# EAGLE design pymodel1 (EAGLE 9.0.0)
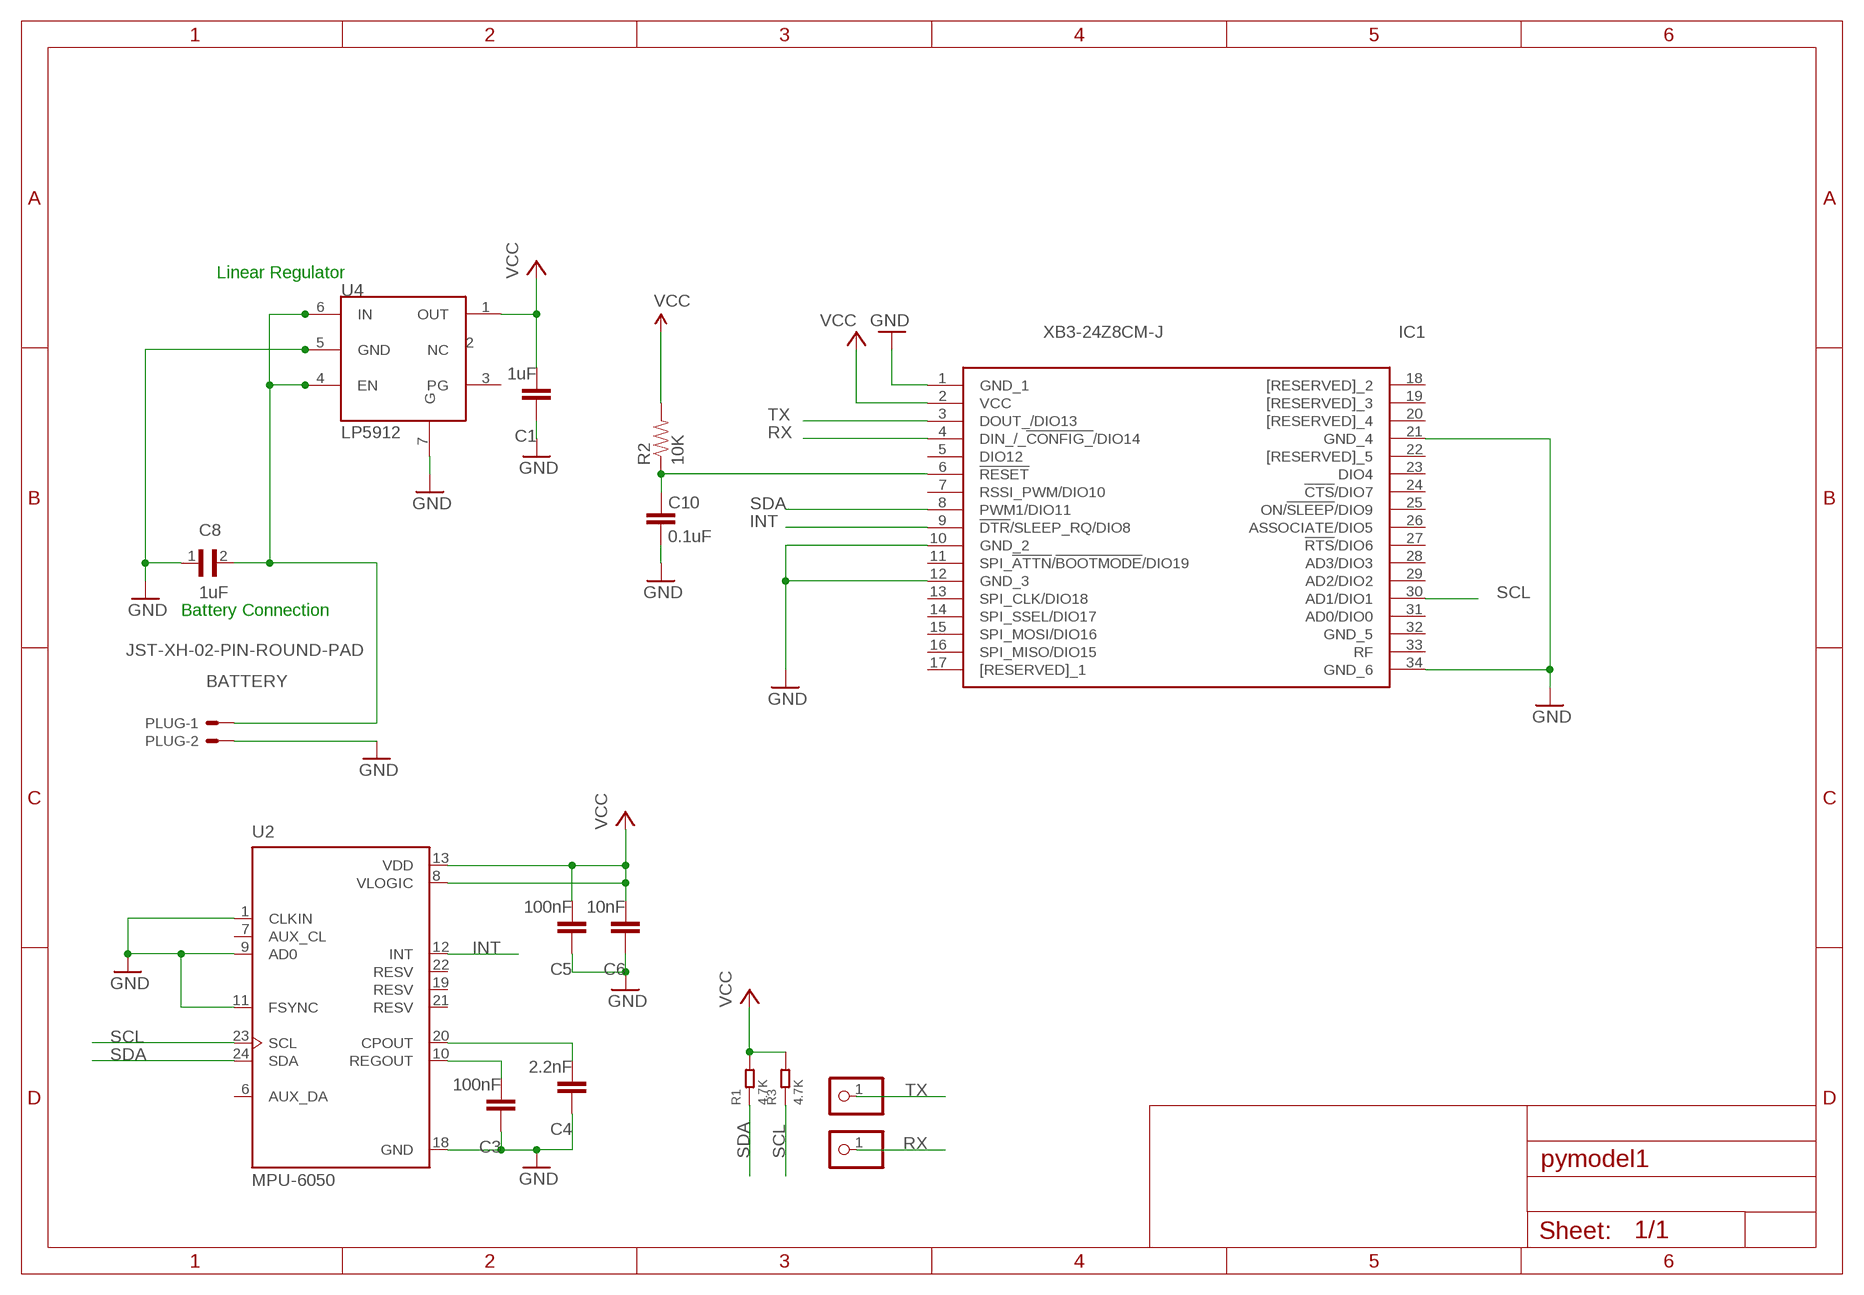
[diagram p0: schematic, sheet 1]

## Parts
C1  1uF  C-EUC0603  [C0603]
C3  100nF  C-EUC0603  [C0603]
C4  2.2nF  C-EUC0603  [C0603]
C5  100nF  C-EUC0603  [C0603]
C6  10nF  C-EUC0603  [C0603]
C8  1uF  0402YD105MAT2A  [CAPC1005X71N]
C10  0.1uF  CAP0603-CAP  [0603-CAP]
IC1  XB3-24Z8CM-J  [XB324Z8CMJ]
PLUG  JST-XH-02-PIN-ROUND-PAD  [JST-XH-02-PACKAGE-ROUND-PAD]
R1  4.7K  SMD-RES-4.7K-5%-1/16W(0402)  [R0402]
R2  10K  RESISTOR0603-RES  [0603-RES]
R3  4.7K  SMD-RES-4.7K-5%-1/16W(0402)  [R0402]
RXX  PINHD-1X1  [1X01]
TXX  PINHD-1X1  [1X01]
U2  MPU-6050  [QFN50P400X400X95-24N]
U4  LP5912  [LP5912]

## Nets
BATTERY: C8.2 PLUG.1 U4.4(EN) U4.6(IN)
GND [vcc]: C1.1 C3.1 C4.1 C5.1 C6.1 C8.1 C10.1 IC1.1(GND_1) IC1.10(GND_2) IC1.12(GND_3) IC1.21(GND_4) IC1.34(GND_6) PLUG.2 U2.1(CLKIN) U2.9(AD0) U2.11(FSYNC) U2.18(GND) U4.5(GND) U4.7(G)
INT: IC1.9(!DTR!/SLEEP_RQ/DIO8) U2.12(INT)
N$3: C3.2 U2.10(REGOUT)
N$4: C4.2 U2.20(CPOUT)
N$6: C10.2 IC1.6(!RESET) R2.1
RX: IC1.4(DIN_/_!CONFIG_!/DIO14) RXX.1
SCL: IC1.30(AD1/DIO1) R3.1 U2.23(SCL)
SDA: IC1.8(PWM1/DIO11) R1.1 U2.24(SDA)
TX: IC1.3(DOUT_/DIO13) TXX.1
VCC: C1.2 C5.2 C6.2 IC1.2(VCC) R1.2 R2.2 R3.2 U2.8(VLOGIC) U2.13(VDD) U4.1(OUT)
Unconnected: IC1.5(DIO12) IC1.7(RSSI_PWM/DIO10) IC1.11(SPI_!ATTN!/!BOOTMODE!/DIO19) IC1.13(SPI_CLK/DIO18) IC1.14(SPI_SSEL/DIO17) IC1.15(SPI_MOSI/DIO16) IC1.16(SPI_MISO/DIO15) IC1.17([RESERVED]_1) IC1.18([RESERVED]_2) IC1.19([RESERVED]_3) IC1.20([RESERVED]_4) IC1.22([RESERVED]_5) IC1.23(DIO4) IC1.24(!CTS!/DIO7) IC1.25(ON/!SLEEP!/DIO9) IC1.26(ASSOCIATE/DIO5) IC1.27(!RTS!/DIO6) IC1.28(AD3/DIO3) IC1.29(AD2/DIO2) IC1.31(AD0/DIO0) IC1.32(GND_5) IC1.33(RF) U2.6(AUX_DA) U2.7(AUX_CL) U2.19(RESV) U2.21(RESV) U2.22(RESV) U4.2(NC) U4.3(PG)

## Notes on the sheet
- Linear Regulator
- Battery Connection

## Library data of the parts
C1 C3-C6 = rcl:C-EU: CAPACITOR, European symbol; SPICEPREFIX: C
C8 = Capacitor1uF:0402YD105MAT2A: CAP 1UF 16VDC X5R 20% SMD 0402; AVAILABILITY: Unavailable; DESCRIPTION: Cap 1uf 16vdc X5r 20% Smd 0402; MF: AVX; MP: 0402YD105MAT2A; PACKAGE: 1005 AVX; PRICE: None
C10 = SparkFun:CAP: Capacitor Standard 0603 ceramic capacitor, and 0.1" leaded capacitor.
IC1 = XB3-24Z8CM-J:XB3-24Z8CM-J: Zigbee Modules (802.15.4) XBee3 ,2.4 Ghz ZB 3.0, Chip Ant, MMT Source: Datasheet <https://www.digi.com/resources/documentation/digidocs/pdfs/90001543.pdf>; DESCRIPTION: Zigbee Modules (802.15.4) XBee3 ,2.4 Ghz ZB 3.0, Chip Ant, MMT; HEIGHT: 4mm; MANUFACTURER_NAME: Digi International; MANUFACTURER_PART_NUMBER: XB3-24Z8CM-J; MOUSER_PART_NUMBER: 888-XB3-24Z8CM-J; MOUSER_PRICE-STOCK: https://www.mouser.com/Search/Refine.aspx?Keyword=888-XB3-24Z8CM-J
PLUG = Rembrandt Electronics - JST XH Connectors v1-0:JST-XH-02-PIN: JST XH Connector 2 Pin Wire to board connector. Pitch: 2,54 mm, (0.100") Number of pins: 2 Created by Rembrandt Electronics www.rembrandtelectronics.com
R1 R3 = RES-4.7K-SMD-5_-1_16W_0402_:SMD-RES-4.7K-5%-1/16W(0402): 301010010; AVAILABILITY: Unavailable; DESCRIPTION: Res Thick Film 0402 4.7K Ohm 5% 0.063W_1/16W_ ?100ppm/C Molded SMD Paper T/R; MF: Yageo; MP: RC0402JR074K7L; PACKAGE: 0402 Yageo; PRICE: None
R2 = SparkFun:RESISTOR: Resistor Basic schematic elements and footprints for 0603, 1206, and PTH resistors.
RXX TXX = pinhead:PINHD-1X1: PIN HEADER
U2 = MPU-6050:MPU-6050: MPU-6050 Six-Axis (Gyro + Accelerometer) MEMS MotionTracking™ Devices; AVAILABILITY: Unavailable; DESCRIPTION: 3-axis gyroscope, 3-axis accelerometer in a 4x4x0.9 housing; MF: TDK InvenSense; MP: MPU-6050; PACKAGE: QFN-24 InvenSense; PRICE: None
U4 = electronic-labs:LP5912

## Net classes
0 default: width 0.203 mm
1 vcc: width 0.254 mm

## Board
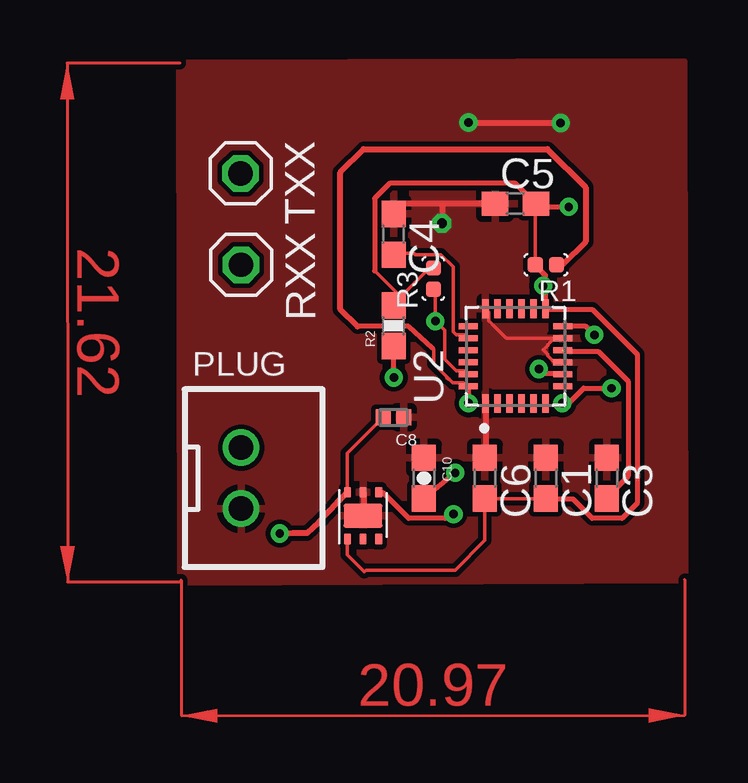
[diagram p1: board, top side]
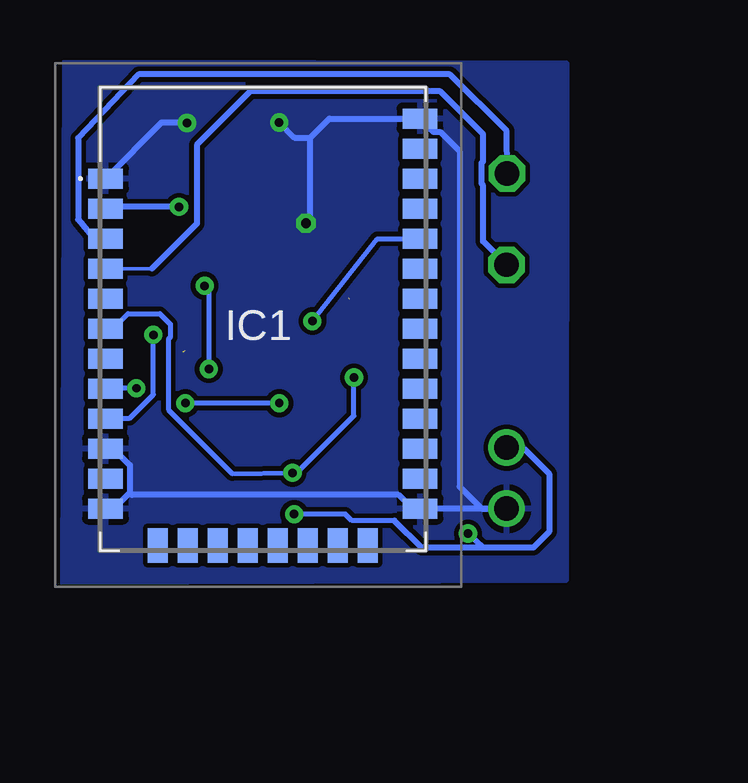
[diagram p2: board, bottom side, seen from below]

No outline drawn. Coordinates in mm, seen from the top.
Copper layers (1*16): Top 0.035mm / dielectric 1.5mm / Bottom 0.035mm
Design rules "default": minimum track width 6mil, minimum drill 0.35mm, track to track 6mil, track to pad 6mil, pad to pad 6mil, via to via 6mil, smd to smd 6mil, copper to edge 40mil, drill to drill 6mil, minimum pad ring 10mil, minimum via ring 8mil, stop-mask expansion 4mil, vias tented up to drill 0mil, thermal gap 10mil

### Footprints (pad centres in the part's own frame; a part is rotated, then mirrored left to right if it is on the bottom)
C0603 = smd 1.1 x 1: 1 -0.85,0; 2 0.85,0
CAPC1005X71N = smd 0.62 x 0.67: 1 -0.425,0; 2 0.425,0
0603-CAP = smd 1.1 x 1: 1 -0.85,0; 2 0.85,0
XB324Z8CMJ = smd 1.448 x 0.838: 1 -6.553,13.75; 2 -6.553,12.5; 3 -6.553,11.25; 4 -6.553,10; 5 -6.553,8.75; 6 -6.553,7.5; 7 -6.553,6.25; 8 -6.553,5; 9 -6.553,3.75; 10 -6.553,2.5; 11 -6.553,1.25; 12 -6.553,0; 21 6.553,0; 22 6.553,1.25; 23 6.553,2.5; 24 6.553,3.75; 25 6.553,5; 26 6.553,6.25; 27 6.553,7.5; 28 6.553,8.75; 29 6.553,10; 30 6.553,11.25; 31 6.553,12.5; 32 6.553,13.75; 33 6.553,15; 34 6.553,16.25 | smd 0.838 x 1.448: 13 -4.375,-1.537; 14 -3.125,-1.537; 15 -1.875,-1.537; 16 -0.625,-1.537; 17 0.625,-1.537; 18 1.875,-1.537; 19 3.125,-1.537; 20 4.375,-1.537
JST-XH-02-PACKAGE-ROUND-PAD = drill 1.016: 1 -1.27,0; 2 1.27,0
R0402 = smd 0.635 x 0.635: 1 0,0.445; 2 0,-0.445
0603-RES = smd 1.1 x 1: 1 -0.85,0; 2 0.85,0
1X01 = drill 1.016 octagon: 1 0,0
QFN50P400X400X95-24N = smd 0.79 x 0.26: 1 -1.97,1.25; 2 -1.97,0.75; 3 -1.97,0.25; 4 -1.97,-0.25; 5 -1.97,-0.75; 6 -1.97,-1.25; 13 1.97,-1.25; 14 1.97,-0.75; 15 1.97,-0.25; 16 1.97,0.25; 17 1.97,0.75; 18 1.97,1.25 | smd 0.26 x 0.79: 7 -1.25,-1.97; 8 -0.75,-1.97; 9 -0.25,-1.97; 10 0.25,-1.97; 11 0.75,-1.97; 12 1.25,-1.97; 19 1.25,1.97; 20 0.75,1.97; 21 0.25,1.97; 22 -0.25,1.97; 23 -0.75,1.97; 24 -1.25,1.97
LP5912 = smd 0.45 x 0.3: 1 0,0.65; 2 0,0; 3 0,-0.65; 4 1.95,-0.65; 5 1.95,0; 6 1.95,0.65 | smd 1 x 1.6: 7 0.975,0

### Placement (x,y rotation side)
C1  10.16,3.81 270 top
C3  12.7,3.81 270 top
C4  3.81,13.97 270 top
C5  8.89,15.24 0 top
C6  7.62,3.81 270 top
C8  3.81,6.35 180 top
C10  5.08,3.81 270 top
IC1  7.62,2.54 0 bottom
PLUG  -2.54,3.81 270 top
R1  10.16,12.7 270 top
R2  3.81,10.16 90 top
R3  5.47,12.13 180 top
RXX  -2.54,12.7 270 top
TXX  -2.56,16.51 270 top
U2  8.89,8.89 90 top
U4  2.54,1.27 90 top

### Tracks (layer width: path | path; a pad name or v marks a point on that pad's centre or on a via)
BATTERY  (via drill 0.35)
  Top 0.152: C8.2 1.89,4.86 U4.6
  Top 0.203: v6.31,2.31 5.96,2.13 4.45,2.13 3.38,3.2 3.2,3.2 U4.4
  Top 0.254: U4.6 1.69,3.02 1.68,3.02 1.46,2.8 1.46,2.79 0.7,1.98 0.2,1.52 -0.39,1.52 v-0.93,1.5
  Bottom 0.203: v6.31,2.31 4.18,2.31 3.91,2.04 2.13,2.04 1.6,1.51
  Bottom 0.254: PLUG.1 -2.59,5.03 -3.28,5.03 -4.31,4 -4.31,1.57 -3.65,0.91 -1.56,0.91 | 2.13,2.04 1,0.91 -1.56,0.91 | v-0.93,1.5 -1.56,0.91
GND  (via drill 0.35, 0.4)
  Top 0.152: U2.9 10.51,8.64 10.24,8.91 10.24,8.98 10.06,9.16 10.24,9.34 10.24,9.37 10.51,9.64 U2.11 8.51,9.64 7.78,10.37 7.78,10.72 U2.18
  Top 0.254: U4.5 2.58,3.2 2.58,2.31 U4.7 2.49,2.58 | C6.1 7.64,4.71 7.64,6.84 U2.1 | C4.1 4.23,15.24 5.84,15.24 | C5.1 5.84,15.24 | 5.84,15.24 5.84,14.45 v5.82,14.43 | v10.78,18.61 7,18.61 6.94,18.54 v6.94,18.63
  Bottom 0.254: 13.16,3.2 13.78,2.58 14.13,2.58 IC1.12 | 13.16,3.2 13.16,4.36 13.78,4.98 14.13,4.98 IC1.10 | 14.13,16.36 IC1.1 11.83,18.63 10.8,18.63 v10.78,18.61 | 0.71,18.76 1.07,18.76 IC1.34 | 1.16,2.58 1.42,2.58 1.96,3.11 13.07,3.11 13.16,3.2 | 1.16,2.58 IC1.21 | IC1.34 0.52,18.24 0.23,18.24 -0.58,17.43 -0.58,3.46 -1.5,2.54 PLUG.2 1.12,2.54 1.16,2.58 | v5.82,14.43 5.64,14.62 5.64,18 | 5.64,18 4.84,18.79 IC1.34 | v6.94,18.63 6.3,18 5.64,18
  pour Bottom (isolate 0.2): 15.9,21.14 15.99,-0.53 -5.04,-0.44 -5.06,21.09
  pour Top (isolate 0.2): 15.91,21.17 15.94,-0.42 -5.07,-0.52 -5.09,21.1
INT  (via drill 0.35)
  Top 0.203: v12.18,9.78 11.82,10.13 10.94,10.13 U2.12
  Bottom 0.203: v12.18,9.78 12.18,7.29 13.16,6.31 14.13,6.31 IC1.9
N$3  (1 unrouted)
  Top 0.203: 10.94,9.07 12.36,9.07 13.6,7.82 13.6,3.91 12.71,3.02 C3.2
N$4
  Top 0.152: U2.20 6.78,9.78 6.43,9.78 6.3,9.91 6.3,12.61 5.79,13.12 4.72,13.12 4.66,13.18 3.87,13.18 C4.2
N$6  (via drill 0.35)
  Top 0.203: v6.38,4.03 5.16,3.02 C10.2 | v3.82,8 3.82,9.25 R2.1
  Bottom 0.203: IC1.6 14.13,10.05 13.87,10.05 13.25,10.67 11.91,10.67 11.47,10.22 11.47,9.69 11.56,9.6 11.56,6.67 8.89,4 v6.38,4.03 6.13,4.09 3.82,6.4 v3.82,8
RX
  Bottom 0.152: 12.24,12.54 IC1.4
  Bottom 0.254: RXX.1 -1.56,13.68 -1.56,16.01 -1.5,16.08 -1.5,16.94 -1.56,17.01 -1.56,18.14 -1.23,18.47 | -1.23,18.47 0.22,19.92 8.13,19.92 10.36,17.7 10.36,14.42 12.24,12.54 | -1.23,18.47
SCL  (via drill 0.35)
  Top 0.152: R3.1 5.55,11.6 v5.55,10.35 5.94,9.96 5.94,8.77 6.43,8.28 6.78,8.28 U2.23
  Top 0.254: 5.47,10.44 v5.55,10.35
  Bottom 0.203: v5.55,10.35 2.85,13.78 1.16,13.78 IC1.30
SDA  (via drill 0.35)
  Top 0.152: 5.43,9.23 5.49,9.18 5.49,8.57 6.03,8.03 6.04,8 6.12,7.94 6.28,7.78 6.71,7.78 6.84,7.64
  Top 0.203: 2.31,10.13 4.45,10.13 5.43,9.23 | 10.67,12.71 R1.1 | 6.84,7.64 U2.24 6.93,7.56 v6.93,6.93 | v12.89,7.56 11.73,7.56 11.11,6.93 v10.85,6.93
  Top 0.254: 2.31,10.13 1.6,10.85 1.6,16.55 2.57,17.52 10.22,17.52 11.81,15.92 11.81,13.67 10.86,12.71 10.67,12.71
  Bottom 0.203: v12.89,7.56 14.13,7.56 IC1.8 | v6.93,6.93 v10.85,6.93
TX
  Top 0.203: -2.49,16.45 TXX.1
  Bottom 0.203: 14.13,13.87 IC1.3
  Bottom 0.254: TXX.1 -2.54,18.27 -0.18,20.64 12.8,20.64 15.32,17.98 15.32,14.6 14.65,13.79 IC1.3
VCC  (via drill 0.35)  (1 unrouted)
  Top 0.152: 3.02,12.45 4,11.47 4,11.26 5.31,12.57 R3.2 | C6.2 C1.2 10.18,2.95 | C6.2 7.62,1.27 | U4.1 1.89,0.62 2.6,-0.09 2.67,-0.02 6.38,-0.02 7.62,1.23 C6.2 | 9.74,12.66 9.78,12.62 | R1.2 9.72,15.02 9.81,15.11
  Top 0.203: 10.13,11.82 10.13,12.27 9.78,12.62 R1.2 | 10.13,11.82 10.13,10.94 U2.13 10.22,10.85 12.09,10.85 13.96,8.98 13.96,2.76 13.34,2.13 12.09,2.13 11.29,2.93 10.22,2.93 C1.2 | v9.87,8.36 10.05,8.18 10.85,8.18 U2.8 | v10.05,11.82 10.13,11.82 | v11.11,15.11 9.81,15.11 9.78,15.11 C5.2 9.69,15.29 8.89,16.09 3.65,16.09 3.02,15.47 3.02,12.45 | 4.04,11.32 R2.2
  Bottom 0.203: v9.87,8.36 9.87,11.65 v10.05,11.82 | 14.13,15.11 IC1.2
  Bottom 0.254: v11.11,15.11 14.13,15.11
(copper drawn outside any net)
  shapes: Top area x2